# Altium schematic sheet CW342_FPGA_MGT.SchDoc: <Enter Sheet Title>
size Letter; Organization: NewAE Technology Inc.; Address1: 1083 Queen St., Suite 196; Address2: Halifax; Address3: NS; Address4: Canada B3H 0B2; SheetNumber: 6; SheetTotal: 9; SheetApproved: NO
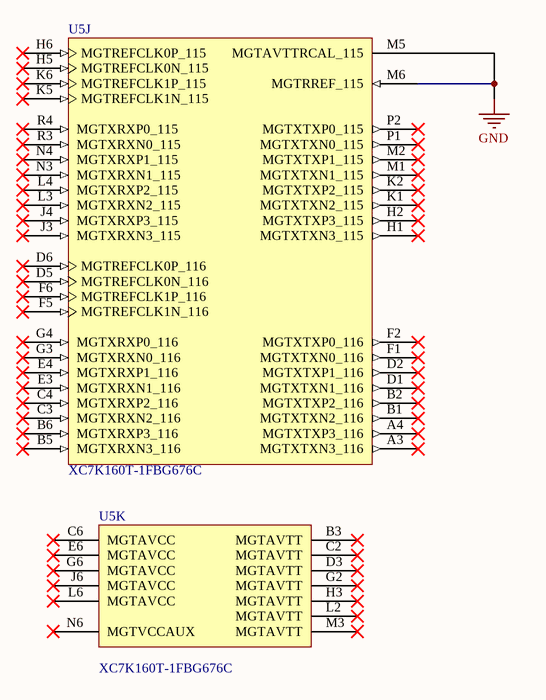
[diagram p0: CW342_FPGA_MGT.SchDoc]

## Parts
U5  XC7K160T-1FBG676C  [FBG676]  (parts J,K of 14)

## Nets
GND: U5.M5(MGTAVTTRCAL_115) U5.M6(MGTRREF_115)

Not connected (* = marked no-connect by the designer): U5 A3(MGTXTXN3_116)* A4(MGTXTXP3_116)* B1(MGTXTXN2_116)* B2(MGTXTXP2_116)* B3(MGTAVTT)* B5(MGTXRXN3_116)* B6(MGTXRXP3_116)* C2(MGTAVTT)* C3(MGTXRXN2_116)* C4(MGTXRXP2_116)* C6(MGTAVCC)* D1(MGTXTXN1_116)* D2(MGTXTXP1_116)* D3(MGTAVTT)* D5(MGTREFCLK0N_116)* D6(MGTREFCLK0P_116)* E3(MGTXRXN1_116)* E4(MGTXRXP1_116)* E6(MGTAVCC)* F1(MGTXTXN0_116)* F2(MGTXTXP0_116)* F5(MGTREFCLK1N_116)* F6(MGTREFCLK1P_116)* G2(MGTAVTT)* G3(MGTXRXN0_116)* G4(MGTXRXP0_116)* G6(MGTAVCC)* H1(MGTXTXN3_115)* H2(MGTXTXP3_115)* H3(MGTAVTT)* H5(MGTREFCLK0N_115)* H6(MGTREFCLK0P_115)* J3(MGTXRXN3_115)* J4(MGTXRXP3_115)* J6(MGTAVCC)* K1(MGTXTXN2_115)* K2(MGTXTXP2_115)* K5(MGTREFCLK1N_115)* K6(MGTREFCLK1P_115)* L2(MGTAVTT)* L3(MGTXRXN2_115)* L4(MGTXRXP2_115)* L6(MGTAVCC)* M1(MGTXTXN1_115)* M2(MGTXTXP1_115)* M3(MGTAVTT)* N3(MGTXRXN1_115)* N4(MGTXRXP1_115)* N6(MGTVCCAUX)* P1(MGTXTXN0_115)* P2(MGTXTXP0_115)* R3(MGTXRXN0_115)* R4(MGTXRXP0_115)*

## Notes on the sheet
- Title:
- Date:
- Rev:
- Time:
- Project:
- Sheet
- of
- License:
- Copyright © NewAE Technology Inc.
- Approved:
- NewAE.com
- File:

## Library data of the parts
U5 = CMP-0361-00025-2: Kintex-7 FPGA, 400 User I/Os, 8 GTX, 676-Ball BGA, Speed Grade 1, Commercial Grade, Pb-Free; Manufacturer: Xilinx; SelectIO HR: 250; GTX: 8; SelectIO HP: 150; Speed Grade: -1; RoHS: Pb-Free; PackageReference: FBG676; Code_JEDEC: MS-034; Mounting Technology: Surface Mount; ComponentLink1URL: http://www.xilinx.com/support/documentation/data_sheets/ds180_7Series_Overview.pdf; DatasheetVersion: v1.12; Generic Part Number: XC7K160T; PartNumber: XC7K160T-1FBG676C; PackageVersion: Rev 1.8; ComponentLink2URL: http://www.xilinx.com/support/documentation/user_guides/ug475_7Series_Pkg_Pinout.pdf; PackageDescription: Flip-Chip Lidless BGA, Body 27 x 27 mm, 1.0 mm Pitch; ComponentLink1Description: Datasheet; ComponentLink2Description: Package Specification